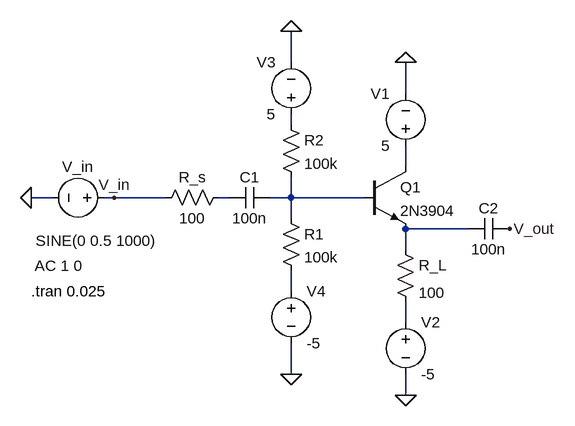
[diagram p0: schematic project3.asc]
project3.asc, the LTspice schematic file:
Version 4
SHEET 1 880 680
WIRE 48 -48 48 -96
WIRE 224 0 224 -48
WIRE 48 48 48 32
WIRE 224 112 224 80
WIRE -320 160 -352 160
WIRE -224 160 -240 160
WIRE -144 160 -224 160
WIRE -48 160 -64 160
WIRE 48 160 48 128
WIRE 48 160 16 160
WIRE 160 160 48 160
WIRE 48 192 48 160
WIRE 320 208 224 208
WIRE 224 240 224 208
WIRE 48 304 48 272
WIRE 224 352 224 320
WIRE 48 432 48 384
WIRE 224 464 224 432
FLAG 384 208 V_out
FLAG -224 160 V_in
FLAG 48 -96 0
FLAG 224 -48 0
FLAG 224 464 0
FLAG 48 432 0
FLAG -352 160 0
SYMBOL npn 160 112 R0
SYMATTR InstName Q1
SYMATTR Value 2N3904
SYMBOL voltage 224 336 R0
SYMATTR InstName V2
SYMATTR Value -5
SYMBOL voltage -224 160 R90
WINDOW 0 -32 56 VBottom 2
WINDOW 3 51 28 VTop 2
WINDOW 123 89 86 VTop 2
WINDOW 39 0 0 Left 0
SYMATTR InstName V_in
SYMATTR Value SINE(0 0.5 1000)
SYMATTR Value2 AC 1 0
SYMBOL res 208 224 R0
WINDOW 3 36 82 Left 2
SYMATTR Value 100
SYMATTR InstName R_L
SYMBOL res -48 144 R90
WINDOW 0 0 56 VBottom 2
WINDOW 3 32 56 VTop 2
SYMATTR InstName R_s
SYMATTR Value 100
SYMBOL res 32 32 R0
SYMATTR InstName R2
SYMATTR Value 100k
SYMBOL res 32 176 R0
SYMATTR InstName R1
SYMATTR Value 100k
SYMBOL cap 16 144 R90
WINDOW 0 0 32 VBottom 2
WINDOW 3 32 32 VTop 2
SYMATTR InstName C1
SYMATTR Value 100n
SYMBOL voltage 48 288 R0
SYMATTR InstName V4
SYMATTR Value -5
SYMBOL voltage 48 48 R180
WINDOW 0 24 96 Left 2
WINDOW 3 24 16 Left 2
SYMATTR InstName V3
SYMATTR Value 5
SYMBOL voltage 224 96 R180
WINDOW 0 24 96 Left 2
WINDOW 3 24 16 Left 2
SYMATTR InstName V1
SYMATTR Value 5
SYMBOL cap 384 192 R90
WINDOW 0 0 32 VBottom 2
WINDOW 3 32 32 VTop 2
SYMATTR InstName C2
SYMATTR Value 100n
TEXT -352 304 Left 2 !.tran 0.025

The netlist it stands for:
* project3.asc
Q1 N002 N004 N005 0 2N3904
V2 N007 0 -5
V_in V_in 0 SINE(0 0.5 1000) AC 1 0
R_L N005 N007 100
R_s N003 V_in 100
R2 N001 N004 100k
R1 N004 N006 100k
C1 N004 N003 100n
V4 N006 0 -5
V3 N001 0 5
V1 N002 0 5
C2 V_out N005 100n
.model NPN NPN
.model PNP PNP
.lib standard.bjt
.tran 0.025
.backanno
.end